# EAGLE schematic lock Schematic v1 (EAGLE 9.7.0)
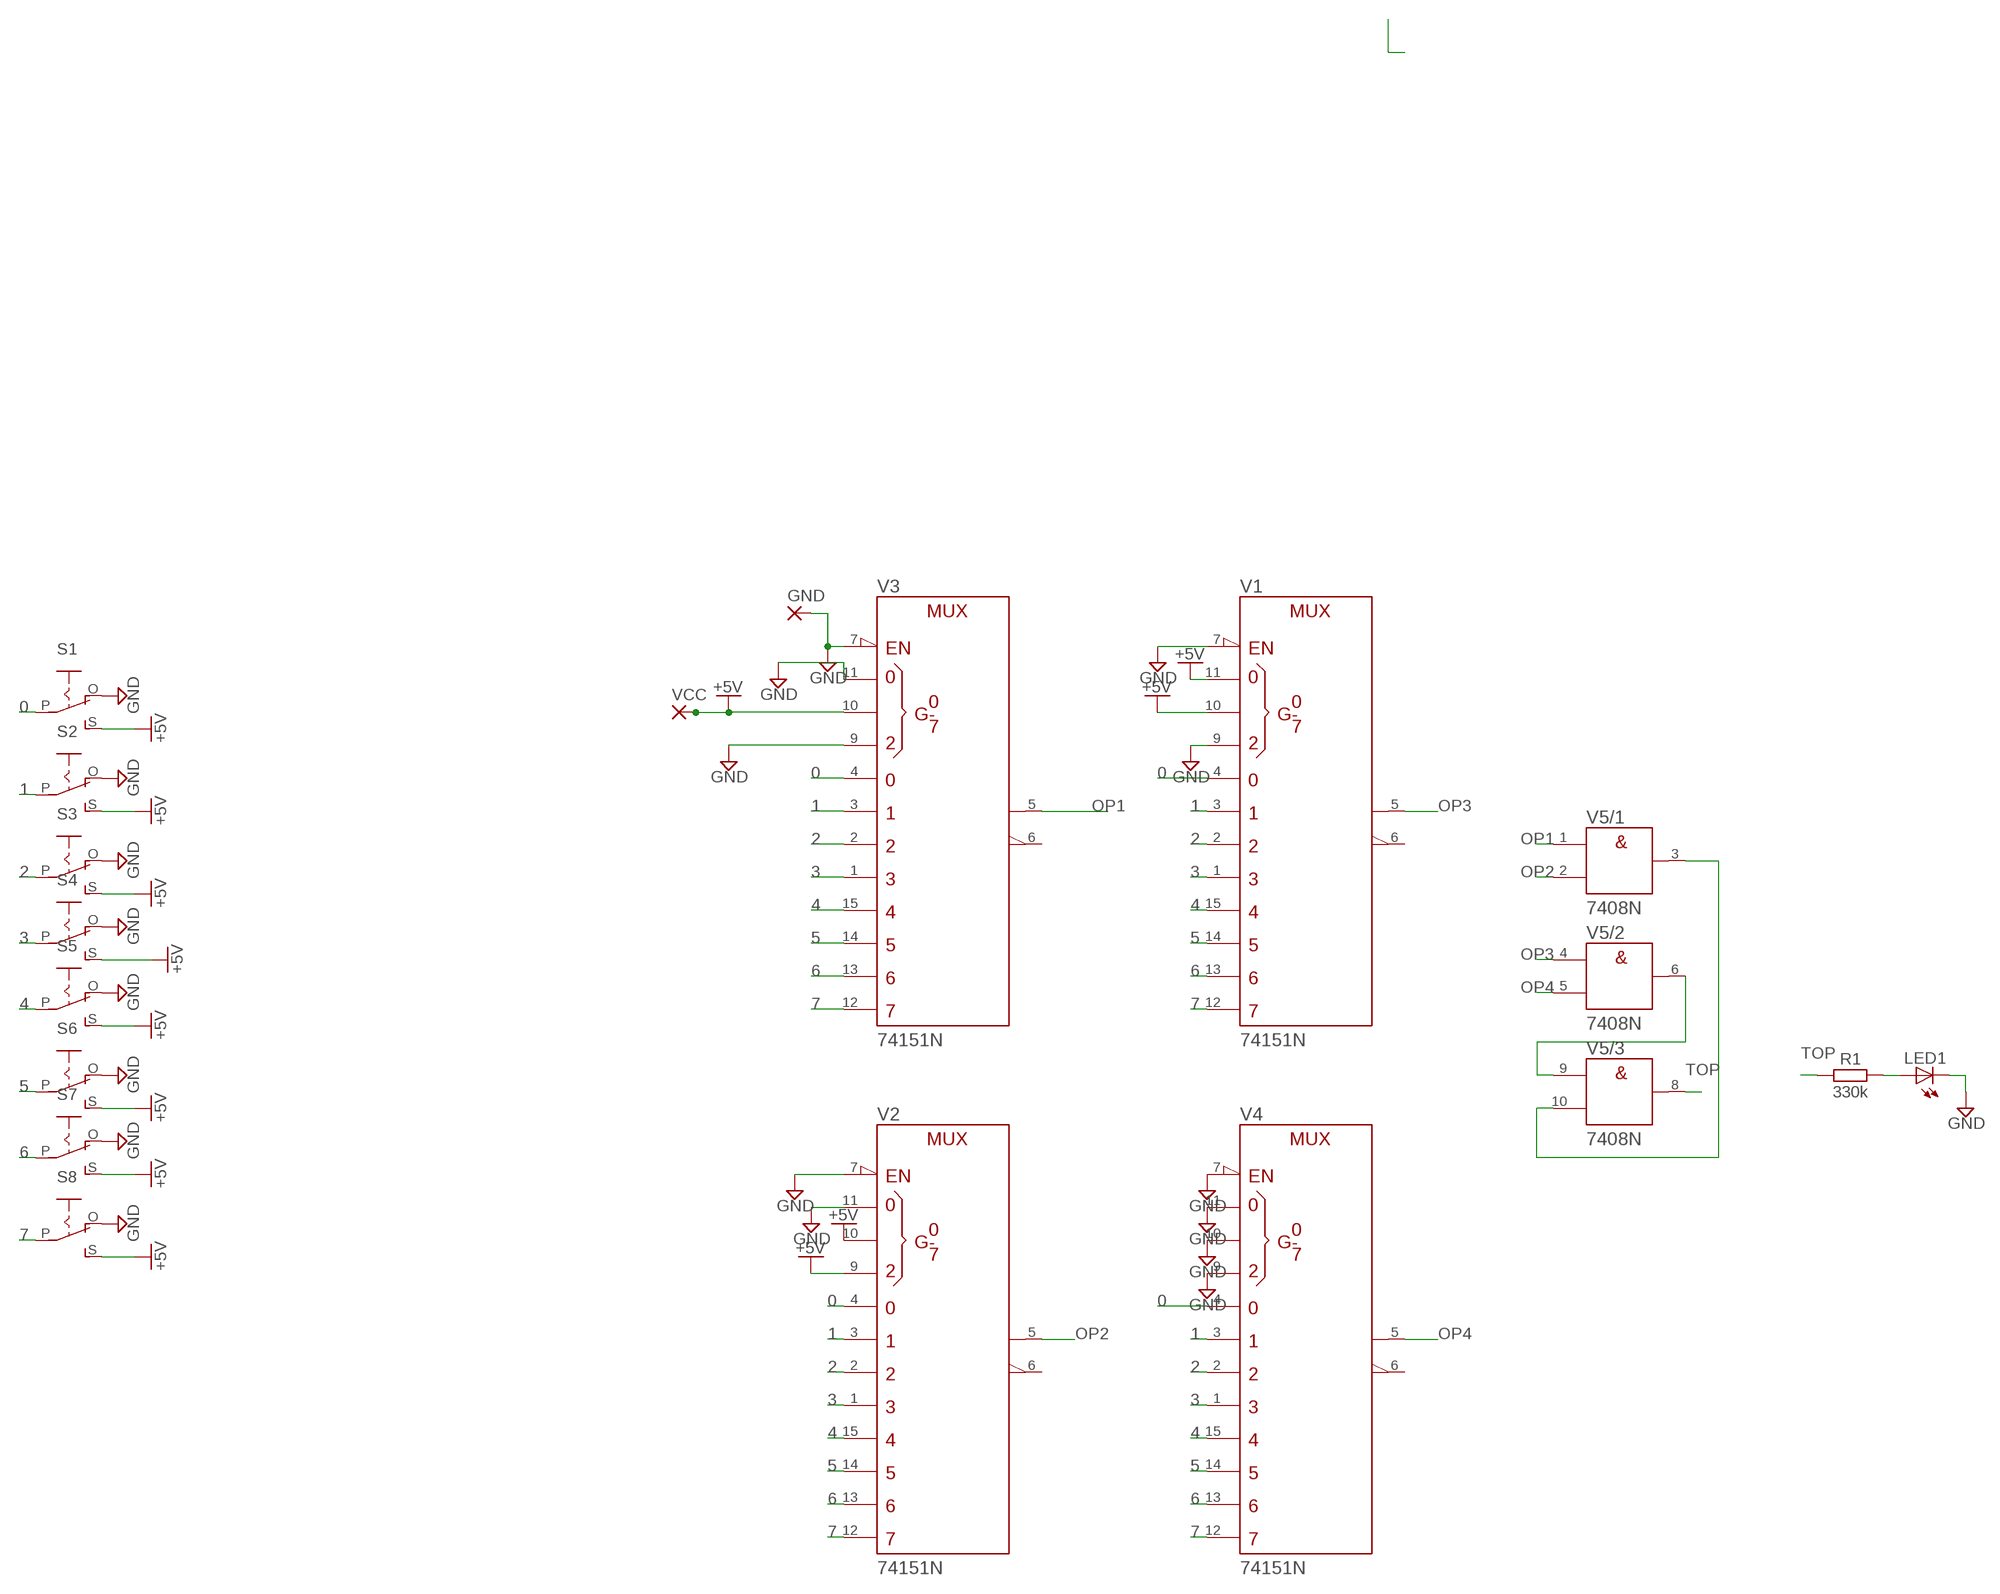
[diagram p0: schematic, sheet 1]

## Parts
GND  3,81/1,4  [3,81/1,4]
LED1  LED5MM  [LED5MM]
R1  330k  RESISTOR__AXIAL-7.2MM-PITCH  [RESAD724W46L381D178B]
S1  EG1218S  [EG1218]
S2  EG1218S  [EG1218]
S3  EG1218S  [EG1218]
S4  EG1218S  [EG1218]
S5  EG1218S  [EG1218]
S6  EG1218S  [EG1218]
S7  EG1218S  [EG1218]
S8  EG1218S  [EG1218]
V1  74151N  [DIL16]
V2  74151N  [DIL16]
V3  74151N  [DIL16]
V4  74151N  [DIL16]
V5  7408N  [DIL14]
VCC  3,81/1,4  [3,81/1,4]

## Nets
0: S1.P V1.4(D0) V2.4(D0) V3.4(D0) V4.4(D0)
1: S2.P V1.3(D1) V2.3(D1) V3.3(D1) V4.3(D1)
2: S3.P V1.2(D2) V2.2(D2) V3.2(D2) V4.2(D2)
3: S4.P V1.1(D3) V2.1(D3) V3.1(D3) V4.1(D3)
4: S5.P V1.15(D4) V2.15(D4) V3.15(D4) V4.15(D4)
5: S6.P V1.14(D5) V2.14(D5) V3.14(D5) V4.14(D5)
6: S7.P V1.13(D6) V2.13(D6) V3.13(D6) V4.13(D6)
7: S8.P V1.12(D7) V2.12(D7) V3.12(D7) V4.12(D7)
+5V: S1.S S2.S S3.S S4.S S5.S S6.S S7.S S8.S V1.10(B) V1.11(A) V2.9(C) V2.10(B) V3.10(B) VCC.1(P)
GND: GND.1(P) LED1.K(C) S1.O S2.O S3.O S4.O S5.O S6.O S7.O S8.O V1.7(!G) V1.9(C) V2.7(!G) V2.11(A) V3.7(!G) V3.9(C) V3.11(A) V4.7(!G) V4.9(C) V4.10(B) V4.11(A)
N$1: LED1.A R1.2
N$8: V5.6(/2:Y) V5.9(/3:A)
N$9: V5.3(/1:Y) V5.10(/3:B)
OP1: V3.5(Y) V5.1(/1:A)
OP2: V2.5(Y) V5.2(/1:B)
OP3: V1.5(Y) V5.4(/2:A)
OP4: V4.5(Y) V5.5(/2:B)
TOP: R1.1 V5.8(/3:Y)
Unconnected: V1.6(W) V2.6(W) V3.6(W) V4.6(W) V5.11(/4:Y) V5.12(/4:A) V5.13(/4:B)

## Power pins joined to a net without a drawn wire
+UB: V1.16(+UB) V2.16(+UB) V3.16(+UB) V4.16(+UB) V5.14(/+UB:+UB)
-UB: V1.8(-UB) V2.8(-UB) V3.8(-UB) V4.8(-UB) V5.7(/-UB:-UB)

## Library data of the parts
GND VCC = wirepad:3,81/1,4: THROUGH-HOLE PAD
LED1 = adafruit:LED: LED OSRAM: - CHIPLED LG R971, LG N971, LY N971, LG Q971, LY Q971, LO R971, LY R971 LH N974, LH R974 LS Q976, LO Q976, LY Q976 LO Q996 - Hyper CHIPLED LW Q18S LB Q993, LB Q99A, LB R99A - SideLED LS A670, LO A670, LY A670, LG A670, LP A670 LB A673, LV A673, LT A673, LW A673 LH A674 LY A675 LS A676, LA A676, LO A676, LY A676, LW A676 LS A679, LY A679, LG A679 - Hyper Micro SIDELED® LS Y876, LA Y876, LO Y876, LY Y876 LT Y87S - SmartLED LW L88C, LW L88S LB L89C, LB L89S, LG L890 LS L89K, LO L89K, LY L89K LS L896, LA L896, LO L896, LY L896 - TOPLED LS T670, LO T670, LY T670, LG T670, LP T670 LSG T670, LSP T670, LSY T670, LOP T670, LYG T670 LG T671, LOG T671, LSG T671 LB T673, LV T673, LT T673, LW T673 LH T674 LS T676, LA T676, LO T676, LY T676, LB T676, LH T676, LSB T676, LW T676 LB T67C, LV T67C, LT T67C, LS T67K, LO T67K, LY T67K, LW E67C LS E67B, LA E67B, LO E67B, LY E67B, LB E67C, LV E67C, LT E67C LW T67C LS T679, LY T679, LG T679 LS T770, LO T770, LY T770, LG T770, LP T770 LB T773, LV T773, LT T773, LW T773 LH T774 LS E675, LA E675, LY E675, LS T675 LS T776, LA T776, LO T776, LY T776, LB T776 LHGB T686 LT T68C, LB T68C - Hyper Mini TOPLED® LB M676 - Mini TOPLED Santana® LG M470 LS M47K, LO M47K, LY M47K Source: http://www.osram.convergy.de/
R1 = Tinkercad:RESISTOR: Resistor Fixed - Generic; CATEGORY: Resistor; SUB-CATEGORY: Fixed
S1-S8 = adafruit:EG1218: SLIDING SWITCH 0.1" spacing through hole, vertical SPDT slide switch http://www.ladyada.net/library/pcb/eaglelibrary.html
V1-V4 = 74ttl-din:74*151: Data SELECTOR/MULTIPLEXER
V5 = 74ttl-din:74*08: Quad 2-input AND gate